# Altium schematic sheet Megabit FINAL TOP.SchDoc: Megabit Final
size A4; DrawnBy: Megabit Team; DocumentNumber: 1; Revision: 1; SheetNumber: 1; SheetTotal: 3
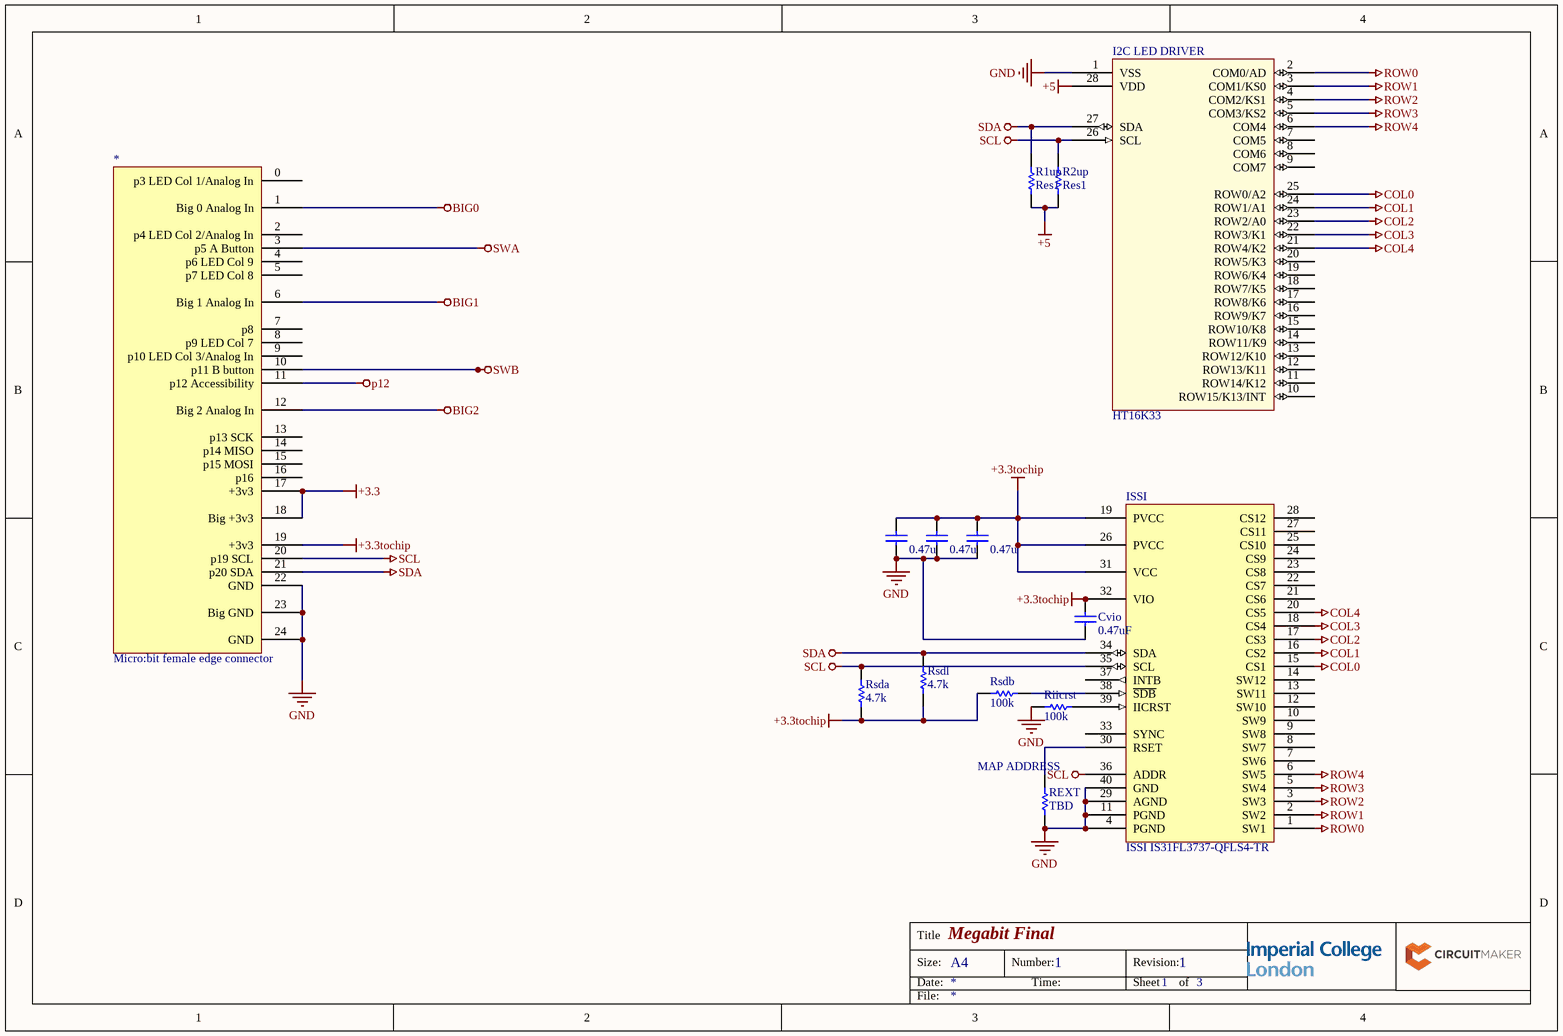
[diagram p0: Megabit FINAL TOP.SchDoc]

## Parts
*  Micro:bit female edge connector  [PCBComponent_1 - duplicate]
Cvcc1  0.47u  [Vishay K104K15X7RF5TL2]
Cvcc2  0.47u  [Vishay K104K15X7RF5TL2]
Cvcc3  0.47u  [Vishay K104K15X7RF5TL2]
Cvio  0.47uF  [Vishay K104K15X7RF5TL2]
I2C_LED_DRIVER  HT16K33  [PCB-otwcc1b496jwxezlenqc-1]
ISSI  ISSI IS31FL3737-QFLS4-TR  [QFN40]
R1up  Res1  [PCB-3613466-1]
R2up  Res1  [PCB-3613466-1]
REXT  TBD  [PCB-3613466-1]
Riicrst  100k  [PCB-3613466-1]
Rsda  4.7k  [PCB-3613466-1]
Rsdb  100k  [PCB-3613466-1]
Rsdl  4.7k  [PCB-3613466-1]

## Nets
+3.3: *.17(+3v3) *.18(Big_+3v3)
+3.3tochip: *.19(+3v3) Cvcc1.2 Cvcc2.2 Cvcc3.2 Cvio.2 ISSI.19(PVCC) ISSI.26(PVCC) ISSI.31(VCC) ISSI.32(VIO) Rsda.2 Rsdb.2 Rsdl.2
+5: I2C_LED_DRIVER.28(VDD) R1up.1 R2up.1
BIG0: *.1(Big_0_Analog_In)
BIG1: *.6(Big_1_Analog_In)
BIG2: *.12(Big_2_Analog_In)
COL0: I2C_LED_DRIVER.25(ROW0/A2) ISSI.15(CS1)
COL1: I2C_LED_DRIVER.24(ROW1/A1) ISSI.16(CS2)
COL2: I2C_LED_DRIVER.23(ROW2/A0) ISSI.17(CS3)
COL3: I2C_LED_DRIVER.22(ROW3/K1) ISSI.18(CS4)
COL4: I2C_LED_DRIVER.21(ROW4/K2) ISSI.20(CS5)
GND: *.22(GND) *.23(Big_GND) *.24(GND) Cvcc1.1 Cvcc2.1 Cvcc3.1 Cvio.1 I2C_LED_DRIVER.1(VSS) ISSI.4(PGND) ISSI.11(PGND) ISSI.29(AGND) ISSI.40(GND) REXT.1 Riicrst.2
p12: *.11(p12_Accessibility)
ROW0: I2C_LED_DRIVER.2(COM0/AD) ISSI.1(SW1)
ROW1: I2C_LED_DRIVER.3(COM1/KS0) ISSI.2(SW2)
ROW2: I2C_LED_DRIVER.4(COM2/KS1) ISSI.3(SW3)
ROW3: I2C_LED_DRIVER.5(COM3/KS2) ISSI.5(SW4)
ROW4: I2C_LED_DRIVER.6(COM4) ISSI.6(SW5)
SCL: *.20(p19_SCL) I2C_LED_DRIVER.26(SCL) ISSI.35(SCL) ISSI.36(ADDR) R2up.2 Rsda.1
SDA: *.21(p20_SDA) I2C_LED_DRIVER.27(SDA) ISSI.34(SDA) R1up.2 Rsdl.1
SWA: *.3(p5_A_Button)
SWB: *.10(p11_B_button)
NetISSI_30: ISSI.30(RSET) REXT.2
NetISSI_38: ISSI.38(~{SDB}) Rsdb.1
NetISSI_39: ISSI.39(IICRST) Riicrst.1

Not connected (* = marked no-connect by the designer): * 0(p3_LED_Col_1/Analog_In) 2(p4_LED_Col_2/Analog_In) 4(p6_LED_Col_9) 5(p7_LED_Col_8) 7(p8) 8(p9_LED_Col_7) 9(p10_LED_Col_3/Analog_In) 13(p13_SCK) 14(p14_MISO) 15(p15_MOSI) 16(p16); I2C_LED_DRIVER 7(COM5) 8(COM6) 9(COM7) 10(ROW15/K13/INT) 11(ROW14/K12) 12(ROW13/K11) 13(ROW12/K10) 14(ROW11/K9) 15(ROW10/K8) 16(ROW9/K7) 17(ROW8/K6) 18(ROW7/K5) 19(ROW6/K4) 20(ROW5/K3); ISSI 7(SW6) 8(SW7) 9(SW8) 10(SW9) 12(SW10) 13(SW11) 14(SW12) 21(CS6) 22(CS7) 23(CS8) 24(CS9) 25(CS10) 27(CS11) 28(CS12) 33(SYNC) 37(INTB)

## Notes on the sheet
- (near REXT) MAP ADDRESS
- Title
- Size:
- Date:
- A4
- Number:
- Time:
- Revision:
- Sheet
- of
- File:

## Library data of the parts
* = CMP-mom7rix79jkpy4z4w6go-15: http://www.dgyuliang.net/html/279.html
Cvcc1-Cvcc3 Cvio = CMP-124240-16: K Series 100nF 50 V ±10 % Tolerance X7R Radial Multilayer Ceramic Capacitor; Manufacturer Part Number: K104K15X7RF5TL2; Lead Length: 30mm; Lead-Free Status: Lead Free; Voltage Rating (DC): 50 V; Capacitance Tolerance: ±10%; Size-Height: 5.6mm; Size-Width: 4.0mm; Mounting Style: Through Hole; OctopartID: e7292e20c87538ee; Number of Pins: 2; Packaging: Cut Tape (CT), Tape & Reel (TR); Capacitance: 100 nF; Octopart URL: http://octopart.com/k104k15x7rf5tl2-vishay+bccomponents-199226; Dielectric Material: Ceramic; Dielectric Characteristic: X7R; Size-Lead Diameter: 0.5mm; RoHS: Compliant; Size-Thickness: 2.6mm
I2C_LED_DRIVER = CMP-58709250411787b7-2: 3M(TM) Stikit(TM) Gold Disc Roll, 01427, 5 in, P100A, 125 discs per roll, 10 rolls per case; REACH SVHC Compliance: No SVHC
ISSI = CMP-21a7ec2d5ed8fe60-2: LED Driver IC 24 Output Linear I²C Dimming 45mA 40-QFN (5x5)
R1up R2up REXT Riicrst Rsda Rsdb Rsdl = CMP-b15c796618a36e9b-3: Resistor 0.25W; OctopartID: b15c796618a36e9b